# Altium schematic sheet Timed Power Switch.SchDoc: Timed Power Switch
size 292 x 193 mm; SheetNumber: 5; SheetTotal: 4
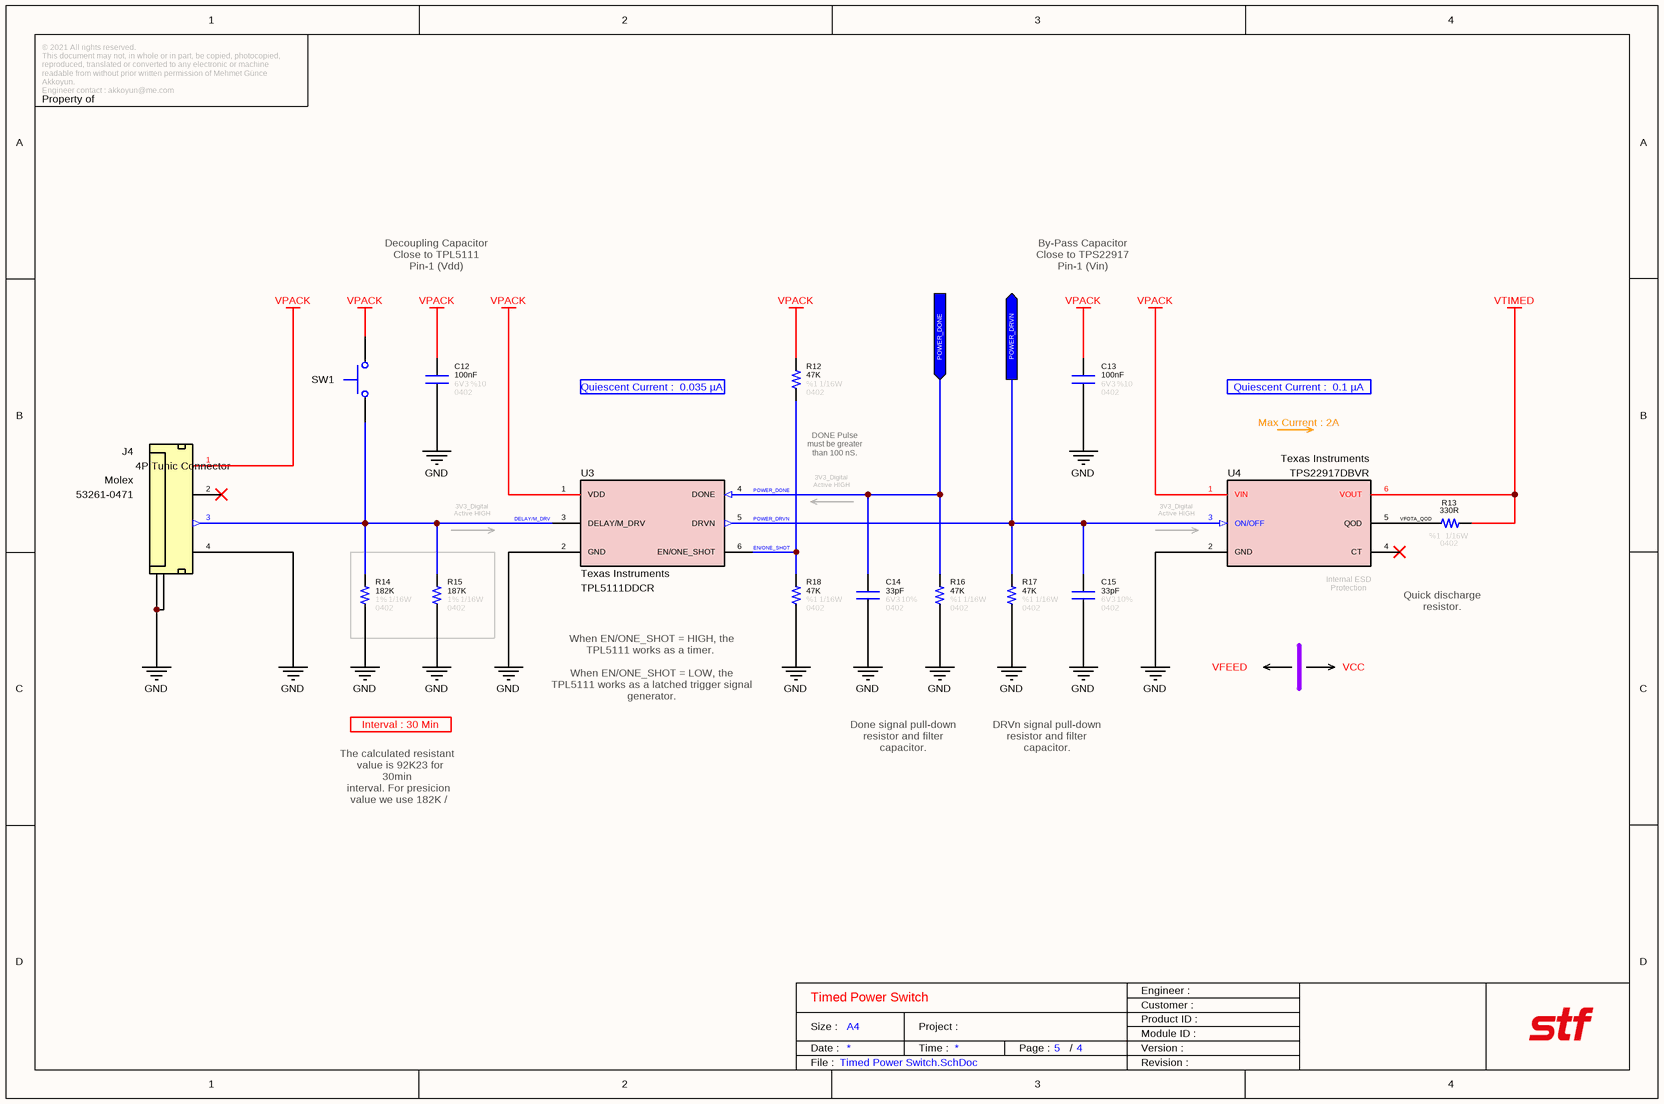
[diagram p0: Timed Power Switch.SchDoc]

## Parts
C12  value 100nF  Tolerance: %10  Voltage: 6V3  Case: 0402  [CAPACITOR_0402]  (hidden comment: Capacitor - 100nF [0402] (Ceramic))
C13  value 100nF  Tolerance: %10  Voltage: 6V3  Case: 0402  [CAPACITOR_0402]  (hidden comment: Capacitor - 100nF [0402] (Ceramic))
C14  value 33pF  Tolerance: 10%  Case: 0402  Voltage: 6V3  [CAPACITOR_0402]  (hidden comment: Capacitor - 33pF [0402] (Ceramic))
C15  value 33pF  Tolerance: 10%  Case: 0402  Voltage: 6V3  [CAPACITOR_0402]  (hidden comment: Capacitor - 33pF [0402] (Ceramic))
J4  Manufacturer Name: Molex  Manufacturer Part Number: 53261-0471  [Connector_Tunic 4P]  (hidden comment: 4P SMD Tunic Connector)
R12  value 47K  Tolerance: %1  Case: 0402  Power: 1/16W  [RESISTOR_0402]  (hidden comment: 47K - 0402 - %1 - 1/16W)
R13  value 330R  Case: 0402  Tolerance: %1  Power: 1/16W  [RESISTOR_0402]  (hidden comment: 330R - 0402 - %1 - 1/16W)
R14  value 182K  Power: 1/16W  Case: 0402  Tolerance: 1%  [RESISTOR_0402]  (hidden comment: 182K - 0402 - %1 - 1/16W)
R15  value 187K  Power: 1/16W  Case: 0402  Tolerance: 1%  [RESISTOR_0402]  (hidden comment: 187K - 0402 - %1 - 1/16W)
R16  value 47K  Tolerance: %1  Case: 0402  Power: 1/16W  [RESISTOR_0402]  (hidden comment: 47K - 0402 - %1 - 1/16W)
R17  value 47K  Tolerance: %1  Case: 0402  Power: 1/16W  [RESISTOR_0402]  (hidden comment: 47K - 0402 - %1 - 1/16W)
R18  value 47K  Tolerance: %1  Case: 0402  Power: 1/16W  [RESISTOR_0402]  (hidden comment: 47K - 0402 - %1 - 1/16W)
SW1  PTS526SK08SMTR2LFS  [PTS526_Switch]  (value not drawn)
U3  Manufacturer Name: Texas Instruments  [SOT-23-6]  (hidden comment: TPL5111DDCR)
U4  Manufacturer Part Number: TPS22917DBVR  Manufacturer Name: Texas Instruments  [SOT-23-6]  (hidden comment: Power Switch)

## Ports
POWER_DONE (in), POWER_DRVN (out)

## Nets
GND: C12.1 C13.1 C14.1 C15.1 J4.4(Pin-4) J4.5(GND) J4.6(GND) R14.1 R15.1 R16.1 R17.1 R18.1 U3.2(GND) U4.2(GND)
VPACK: C12.2 C13.2 J4.1(Pin-1) R12.2 SW1.2(COM) U3.1(VDD) U4.1(VIN)
VTIMED: R13.1 U4.6(VOUT)
DELAY/M_DRV: J4.3(Pin-3) R14.2 R15.2 SW1.1(NC) U3.3(DELAY/M_DRV)
EN/ONE_SHOT: R12.1 R18.2 U3.6(EN/ONE_SHOT)
POWER_DONE: C14.2 R16.2 U3.4(DONE) ; port POWER_DONE
POWER_DRVN: C15.2 R17.2 U3.5(DRVN) U4.3(ON/OFF) ; port POWER_DRVN
VFOTA_QOD: R13.2 U4.5(QOD)

Not connected (* = marked no-connect by the designer): J4 2(Pin-2)*; U4 4(CT)*

## Notes on the sheet
- Decoupling Capacitor
  Close to TPL5111
  Pin-1 (Vdd)
- By-Pass Capacitor
  Close to TPS22917
  Pin-1 (Vin)
- Quiescent Current :  0.035 µA
- Quiescent Current :  0.1 µA
- (near R12) DONE Pulse must be greater than 100 nS.
- (near U4) Max Current : 2A
- 3V3_Digital
  Active HIGH
- (near U4) 3V3_Digital
  Active HIGH
- (near U4) Internal ESD Protection
- (near U4) Quick discharge resistor.
- VFEED
- VCC
- Interval : 30 Min
- When EN/ONE_SHOT = HIGH, the TPL5111 works as a timer.
  When EN/ONE_SHOT = LOW, the TPL5111 works as a latched trigger signal generator.
- Done signal pull-down resistor and filter capacitor.
- DRVn signal pull-down resistor and filter capacitor.
- The calculated resistant
  value is 92K23 for 30min
  interval. For presicion
  value we use 182K /
  187K parallel.
- © 2021 All rights reserved.
  This document may not, in whole or in part, be copied, photocopied, reproduced, translated or converted to any electronic or machine readable from without prior written permission of Mehmet Günce Akkoyun.
  Engineer contact : akkoyun@me.com
- Property of
- Engineer :
- Date :
- Size :
- A4
- Time :
- Project :
- Page :
- /
- Customer :
- Product ID :
- Module ID :
- Version :
- File :
- Revision :
- (in symbol Connector - Mini Tunic 4P (1.25)) 4P Tunic Connector

## Library data of the parts
C12 C13 = Capacitor - 100nF [0402-6V3]: Capacitor - 100nF [0402-6V3] (Ceramic); Manufacturer Name: AVX; Manufacturer Part Number: 04026D104KAT4A; ComponentLink1Description: Mouser; ComponentLink1URL: https://www.mouser.com.tr/ProductDetail/AVX/04026D104KAT4A?qs=sGAEpiMZZMs0AnBnWHyRQPg4iYkCw7IMED%2F4kpqgf7w%3D; ComponentLink2Description: DataSheet; ComponentLink2URL: https://www.mouser.com.tr/datasheet/2/40/cx5r-776519.pdf
C14 C15 = Capacitor - 33pF [0402-6V3]: Manufacturer Name: Kemet; Manufacturer Part Number: C0402C330J9RACAUTO; ComponentLink1Description: DataSheet; ComponentLink1URL: https://api.kemet.com/component-edge/download/datasheet/C0402C330J9RACAUTO.pdf; ComponentLink2Description: Mouser; ComponentLink2URL: https://www.mouser.com/Search/Refine.aspx?Keyword=80-C0402C330J9RAUTO
J4 = Connector - Mini Tunic 4P (1.25): Mini Tunic Connector with 4P; Pitch: 1.25mm; Position: 4; ROHS: Yes; ComponentLink1Description: DataSheet; ComponentLink1URL: https://www.mouser.com.tr/datasheet/2/276/0532610471_PCB_HEADERS-170942.pdf; ComponentLink2Description: Mouser; ComponentLink2URL: https://www.mouser.com.tr/ProductDetail/Molex/53261-0471?qs=%2Fha2pyFaduhLhIsk8tywtK7BwWtguBSP4XxyDBTOTfs%3D; Case: SMD
R12 R16-R18 = Resistor - 47K [0402]: Thick Film Resistors - SMD 1/16 W 47 KOhm 1%; Manufacturer Name: Vishay; Manufacturer Part Number: CRCW040247K0FKED; ComponentLink1Description: DataSheet; ComponentLink1URL: https://www.mouser.com.tr/datasheet/2/427/dcrcwe3-1762152.pdf; ComponentLink2Description: Mouser; ComponentLink2URL: https://www.mouser.com.tr/ProductDetail/Vishay-Dale/CRCW040247K0FKED?qs=sGAEpiMZZMu61qfTUdNhG2DpbjADlD3GL%252B3h1elTxqU%3D
R13 = Resistor - 330R [0402]: Thick Film Resistors - SMD 1/16 W 330 Ohm 1%; Manufacturer Name: Vishay; Manufacturer Part Number: CRCW0402330RFKED; ComponentLink1Description: DataSheet; ComponentLink1URL: https://www.mouser.com.tr/datasheet/2/427/dcrcwe3-1762152.pdf; ComponentLink2Description: Mouser; ComponentLink2URL: https://www.mouser.com.tr/ProductDetail/Vishay-Dale/CRCW0402330RFKED?qs=sGAEpiMZZMu61qfTUdNhG2DpbjADlD3GGS6SwBlLi5Q%3D
R14 = Resistor - 182K [0402]: Thick Film Resistors - SMD 1/16 W 182 KOhm 1%; Manufacturer Name: Vishay; Manufacturer Part Number: CRCW0402182KFKEDC
R15 = Resistor - 187K [0402]: Thick Film Resistors - SMD 1/16 W 187 KOhm 1%; Manufacturer Name: Vishay; Manufacturer Part Number: CRCW0402182KFKEDC
SW1 = Switch - Push Button: Switch Tactile N.O. SPST Flush Round Button Gull Wing 0.05A 12VDC 200000Cycles 2.45N SMD T/R; Manufacturer Name: C&K Switches; Current Rating: 50 mA; Contact Form: SPST; Product Type: Tactile Switches; RoHS: Yes; Voltage Rating: 12 VDC; Case: SMD; Manufacturer Part Number: PTS526SK08SMTR2LFS
U3 = IC - TPL5111: NANO-POWER SYSTEM TIMER FOR POWE; Maximum Operating Temperature: + 105 C; Minimum Operating Temperature: - 40 C; RoHS: Yes; Case: SOT-23-6; Product Type: Timers; Manufacturer Part Number: TPL5111DDCR
U4 = IC - TPS22917: Power Switch MosFet; Height: 1.45mm; ComponentLink1Description: DataSheet; ComponentLink1URL: http://www.ti.com/lit/gpn/tps22917; ComponentLink2Description: Mouser; ComponentLink2URL: https://www.mouser.com/Search/Refine.aspx?Keyword=595-TPS22917DBVR; Case: SOT-23-6